# EAGLE design SPI LCD Backpack (EAGLE 6.5.0)
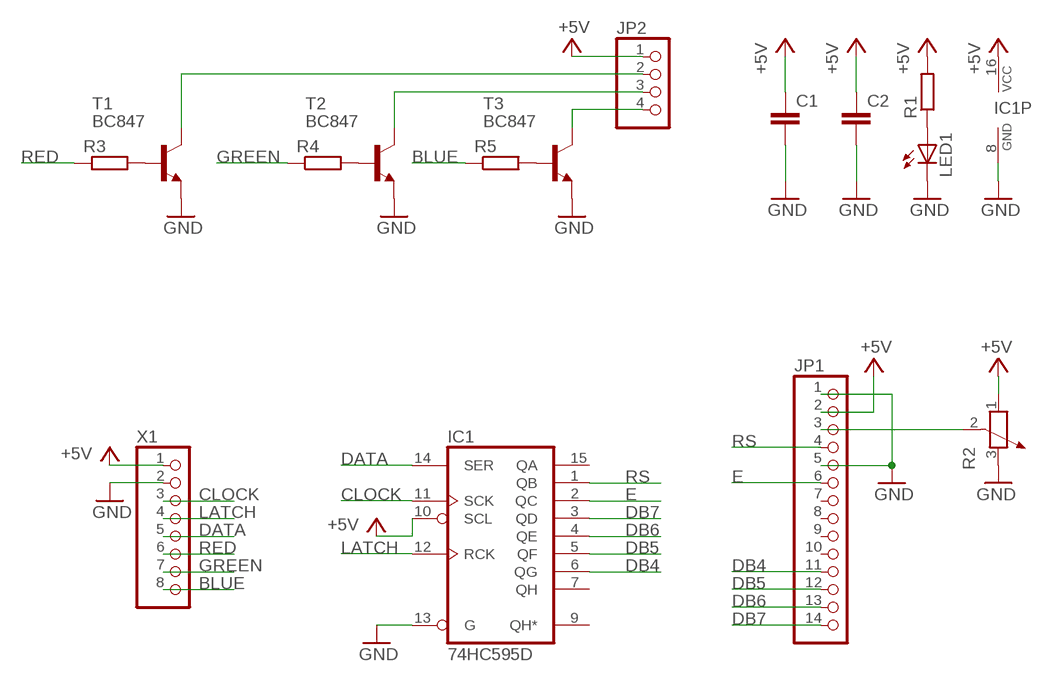
[diagram p0: schematic, sheet 1]

## Parts
C1  C-EUC0805K  [C0805K]
C2  C-EUC0805K  [C0805K]
IC1  74HC595D  [SO16]
JP1  PINHD-1X14  [1X14]
JP2  PINHD-1X4  [1X04]
LED1  LED3MM  [LED3MM]
R1  R-EU_0805  [R0805]
R2  POTENTIOMETER_3386F  [3386F]
R3  R-EU_0805  [R0805]
R4  R-EU_0805  [R0805]
R5  R-EU_0805  [R0805]
T1  BC847  [SOT23]
T2  BC847  [SOT23]
T3  BC847  [SOT23]
X1  22-23-2081  [22-23-2081]

## Nets
+5V: C1.1 C2.1 IC1.10(SCL) IC1.16(VCC) JP1.2 JP2.1 R1.2 R2.1 X1.1
BLUE: R5.1 X1.8
CLOCK: IC1.11(SCK) X1.3
DATA: IC1.14(SER) X1.5
DB4: IC1.6(QG) JP1.11
DB5: IC1.5(QF) JP1.12
DB6: IC1.4(QE) JP1.13
DB7: IC1.3(QD) JP1.14
E: IC1.2(QC) JP1.6
GND: C1.2 C2.2 IC1.8(GND) IC1.13(G) JP1.1 JP1.5 LED1.K(C) R2.3 T1.2(E) T2.2(E) T3.2(E) X1.2
GREEN: R4.1 X1.7
LATCH: IC1.12(RCK) X1.4
N$1: R3.2 T1.1(B)
N$2: R4.2 T2.1(B)
N$3: R5.2 T3.1(B)
N$4: LED1.A R1.1
N$5: JP1.3 R2.2
N$6: JP2.2 T1.3(C)
N$7: JP2.3 T2.3(C)
N$8: JP2.4 T3.3(C)
RED: R3.1 X1.6
RS: IC1.1(QB) JP1.4
Unconnected: IC1.7(QH) IC1.9(QH*) IC1.15(QA) JP1.7 JP1.8 JP1.9 JP1.10

## Library data of the parts
C1 C2 = SPI LCD Backpack:C-EU: CAPACITOR, European symbol
IC1 = SPI LCD Backpack:74*595: 8-bit SHIFT REGISTER, output latch
JP1 = SPI LCD Backpack:PINHD-1X14: PIN HEADER
JP2 = SPI LCD Backpack:PINHD-1X4: PIN HEADER
LED1 = SPI LCD Backpack:LED
R1 R3-R5 = SPI LCD Backpack:R-EU_: RESISTOR, European symbol
R2 = SPI LCD Backpack:POTENTIOMETER_: Potentiometer
T1-T3 = SPI LCD Backpack:BC847: NPN TRANSISTOR
X1 = SPI LCD Backpack:22-23-2081: .100" (2.54mm) Center Header - 8 Pin; MF: MOLEX; MPN: 22-23-2081; OC_FARNELL: 1756826; OC_NEWARK: 01C7592

## Board
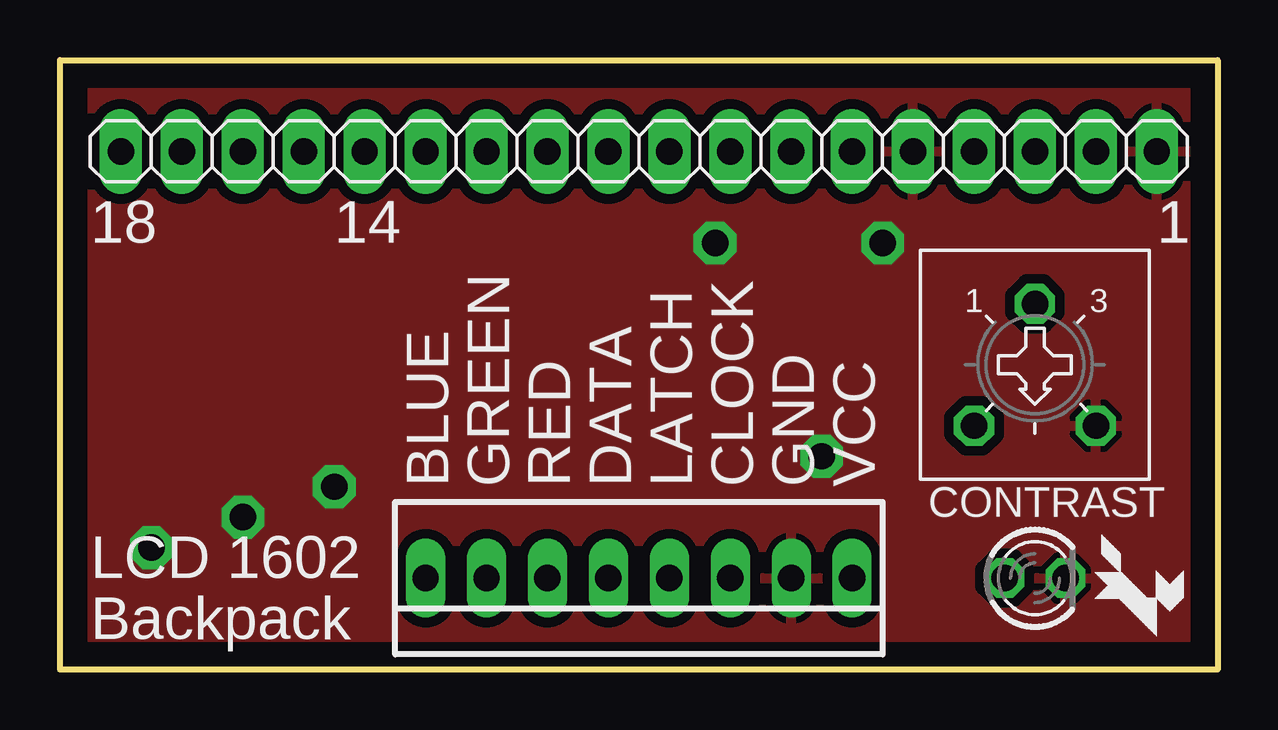
[diagram p1: board, top side]
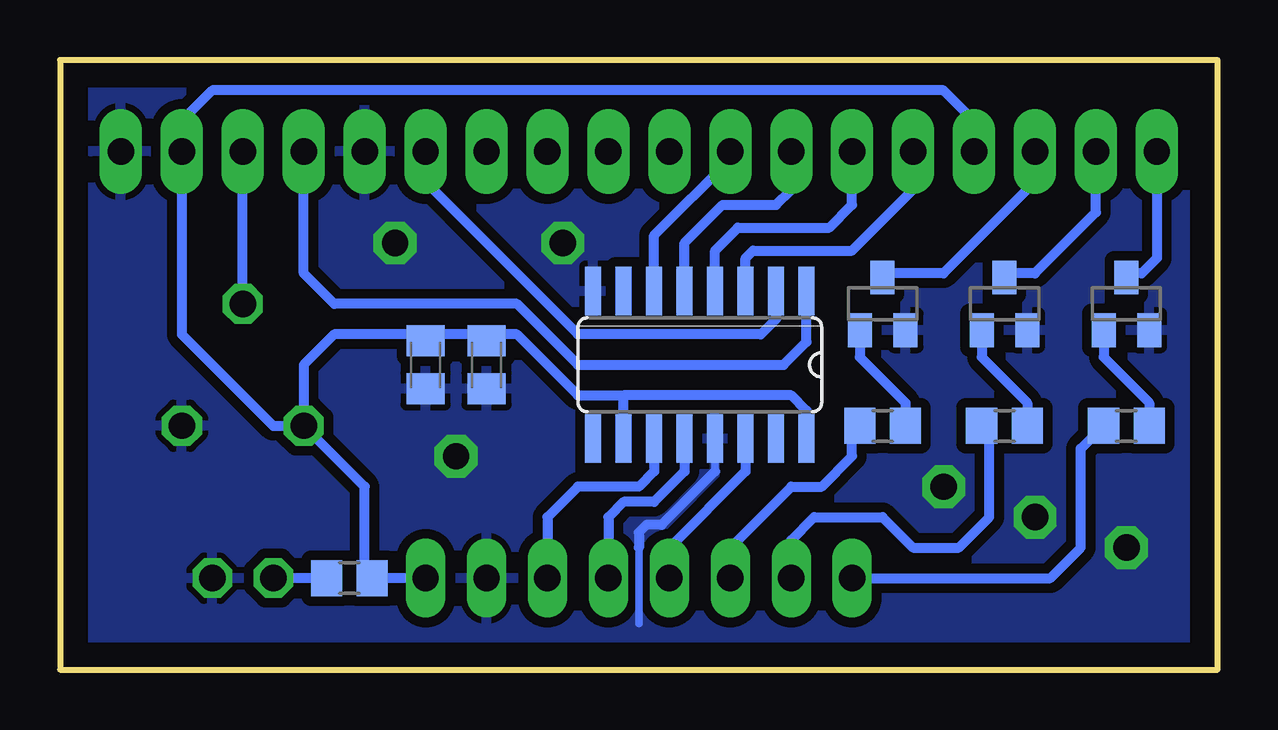
[diagram p2: board, bottom side, seen from below]

Size 48.26 x 25.4 mm. Coordinates in mm from the lower left corner, seen from the top.
Outline: 0,0 0,25.4 48.26,25.4 48.26,0 0,0
Copper layers (1*16): Top 0.035mm / dielectric 1.5mm / Bottom 0.035mm
Design rules "default": minimum track width 10mil, minimum drill 24mil, track to track 8mil, track to pad 8mil, pad to pad 8mil, via to via 8mil, smd to smd 8mil, copper to edge 40mil, drill to drill 8mil, minimum pad ring 10mil, minimum via ring 8mil, stop-mask expansion 4mil, vias tented up to drill 0mil, thermal gap 10mil

### Footprints (pad centres in the part's own frame; a part is rotated, then mirrored left to right if it is on the bottom)
C0805K = smd 1.3 x 1.6: 1 -1,0; 2 1,0
SO16 = smd 0.66 x 2.032: 1 -4.445,-3.073; 2 -3.175,-3.073; 3 -1.905,-3.073; 4 -0.635,-3.073; 5 0.635,-3.073; 6 1.905,-3.073; 7 3.175,-3.073; 8 4.445,-3.073; 9 4.445,3.073; 10 3.175,3.073; 11 1.905,3.073; 12 0.635,3.073; 13 -0.635,3.073; 14 -1.905,3.073; 15 -3.175,3.073; 16 -4.445,3.073
1X14 = drill 1.1 pad 1.778 long: 1 -16.51,0; 2 -13.97,0; 3 -11.43,0; 4 -8.89,0; 5 -6.35,0; 6 -3.81,0; 7 -1.27,0; 8 1.27,0; 9 3.81,0; 10 6.35,0; 11 8.89,0; 12 11.43,0; 13 13.97,0; 14 16.51,0
1X04 = drill 1.1 pad 1.778 long: 1 -3.81,0; 2 -1.27,0; 3 1.27,0; 4 3.81,0
LED3MM = drill 1.1 octagon: A -1.27,0; K 1.27,0
R0805 = smd 1.3 x 1.5: 1 -0.95,0; 2 0.95,0
3386F = drill 1.1 pad 1.676 octagon: 1 2.54,2.54; 2 0,-2.54; 3 -2.54,2.54
SOT23 = smd 1 x 1.4: 1 -0.95,-1.1; 2 0.95,-1.1; 3 0,1.1
22-23-2081 = drill 1.1 long: 1 -8.89,0; 2 -6.35,0; 3 -3.81,0; 4 -1.27,0; 5 1.27,0; 6 3.81,0; 7 6.35,0; 8 8.89,0

### Placement (x,y rotation side)
C1  1uF  [C0805K]  30.48,12.7 270 bottom
C2  100nF  [C0805K]  33.02,12.7 270 bottom
IC1  21.59,12.7 180 bottom
JP1  29.21,21.59 180 top
JP2  6.35,21.59 180 top
LED1  40.64,3.81 0 top
R1  1k  [R0805]  36.2,3.81 0 bottom
R2  40.64,12.7 180 top
R3  10k  [R0805]  13.97,10.16 0 bottom
R4  10k  [R0805]  8.89,10.16 0 bottom
R5  10k  [R0805]  3.81,10.16 0 bottom
T1  13.97,15.24 0 bottom
T2  8.89,15.24 0 bottom
T3  3.81,15.24 0 bottom
U$1  [FOX-1]  45.08,3.49 0 top
X1  24.13,3.81 180 top

### Tracks (layer width: path | path; a pad name or v marks a point on that pad's centre or on a via)
+5V
  Bottom 0.406: X1.1 R1.2 35.56,4.12 35.56,7.62 R2.1 | JP2.1 10.16,22.86 11.43,24.13 41.91,24.13 43.18,22.86 JP1.2 43.18,13.97 39.37,10.16 R2.1 | IC1.16 17.14,10.79 17.78,11.43 24.77,11.43 | IC1.10 24.77,11.43 | 29.84,13.97 30.75,13.97 | 30.75,13.97 33.02,13.97 | 33.02,13.97 36.83,13.97 38.1,12.7 R2.1 | 24.77,11.43 26.67,11.43 29.21,13.97 29.84,13.97 | 29.84,13.97 30.12,13.7 C1.1 30.75,13.97 | C2.1 33.02,13.97
BLUE
  Bottom 0.406: X1.8 6.99,3.81 5.71,5.08 5.71,9.21 R5.1
CLOCK
  Bottom 0.406: IC1.11 23.5,8.26 24.13,7.62 26.67,7.62 27.94,6.35 X1.3
DATA
  Bottom 0.406: IC1.14 19.68,8.26 22.86,5.08 X1.5
DB4
  Bottom 0.406: IC1.6 23.5,18.1 20.32,21.27 JP1.11
DB5
  Bottom 0.406: IC1.5 22.23,17.78 20.64,19.37 18.41,19.37 17.78,20 JP1.12
DB6
  Bottom 0.406: IC1.4 20.96,17.46 20,18.41 16.19,18.41 15.24,19.37 JP1.13
DB7
  Bottom 0.406: IC1.3 19.68,17.14 19.37,17.46 15.24,17.46 12.7,20 JP1.14
E
  Bottom 0.406: IC1.2 18.41,14.61 19.05,13.97 26.67,13.97 33.02,20.32 JP1.6
GND  (via drill 1.1 pad 1.78)
  Bottom 0.305: IC1.13 20.96,8.26 | 24.13,5.08 24.13,1.91
  Bottom 0.406: 20.96,8.26 23.18,6.03 23.81,6.03 24.13,5.71 24.13,5.08
  other vias: 7.62,6.35 3.81,5.08 11.43,7.62 31.75,8.89 27.3,17.78 34.29,17.78
  pour Bottom (isolate 0.406): -1.27,26.67 -1.27,0 49.53,0 49.53,26.67
  pour Top (isolate 0.406): -1.27,26.67 -1.27,-1.27 49.53,-1.27 49.53,26.67
GREEN
  Bottom 0.406: X1.7 17.78,5.4 16.83,6.35 13.97,6.35 12.7,5.08 10.79,5.08 9.53,6.35 9.53,9.85 R4.1
LATCH
  Bottom 0.406: IC1.12 22.23,8.26 23.5,6.99 24.77,6.99 25.4,6.35 X1.4
N$1
  Bottom 0.406: 13.02,9.7 R3.2 13.02,11.11 14.92,13.02 T1.1
N$2
  Bottom 0.406: 7.94,9.7 R4.2 7.94,11.11 9.84,13.02 T2.1
N$3
  Bottom 0.406: 2.86,9.7 R5.2 2.86,11.11 4.76,13.02 T3.1
N$4
  Bottom 0.406: R1.1 LED1.A
N$5
  Bottom 0.406: R2.2 JP1.3
N$6
  Bottom 0.406: JP2.2 7.62,20.32 11.43,16.51 13.8,16.51 T1.3
N$7
  Bottom 0.406: T2.3 8.72,16.51 7.62,16.51 5.08,19.05 JP2.3
N$8
  Bottom 0.406: JP2.4 2.54,17.14 3.18,16.51 3.64,16.51 T3.3
RED
  Bottom 0.406: X1.6 20.32,5.08 17.78,7.62 16.51,7.62 15.24,8.89 15.24,9.84 R3.1
RS
  Bottom 0.406: IC1.1 17.14,13.65 18.1,12.7 26.67,12.7 29.21,15.24 36.83,15.24 38.1,16.51 JP1.4

### Text on the board
tPlace: BLUE | GREEN | RED | DATA | LATCH | CLOCK | GND | VCC | CONTRAST | LCD 1602 | Backpack
tNames: 18 | 14 | 1